# EAGLE schematic INA219-SOT23 (EAGLE 8.1.1)
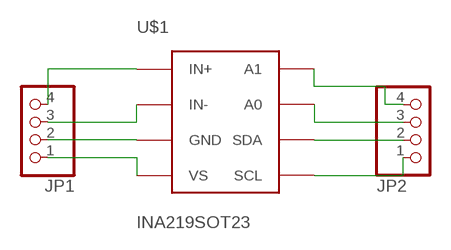
[diagram p0: schematic, sheet 1]

## Parts
JP1  PINHD-1X4  [1X04]
JP2  PINHD-1X4  [1X04]
U$1  INA219SOT23  [SOT-23-8]

## Nets
N$1: JP1.4 U$1.P$1(IN+)
N$2: JP1.3 U$1.P$2(IN-)
N$3: JP1.2 U$1.P$3(GND)
N$4: JP1.1 U$1.P$4(VS)
N$5: JP2.1 U$1.P$5(SCL)
N$6: JP2.2 U$1.P$6(SDA)
N$7: JP2.3 U$1.P$7(A0)
N$8: JP2.4 U$1.P$8(A1)

## Library data of the parts
JP1 JP2 = pinhead:PINHD-1X4: PIN HEADER
U$1 = texas:INA219: TI INA219 Voltage/Current/Power monitor with I2C Datasheet <http://www.ti.com/lit/ds/symlink/ina219.pdf>